# Altium project GateDriver_board.PrjPCB
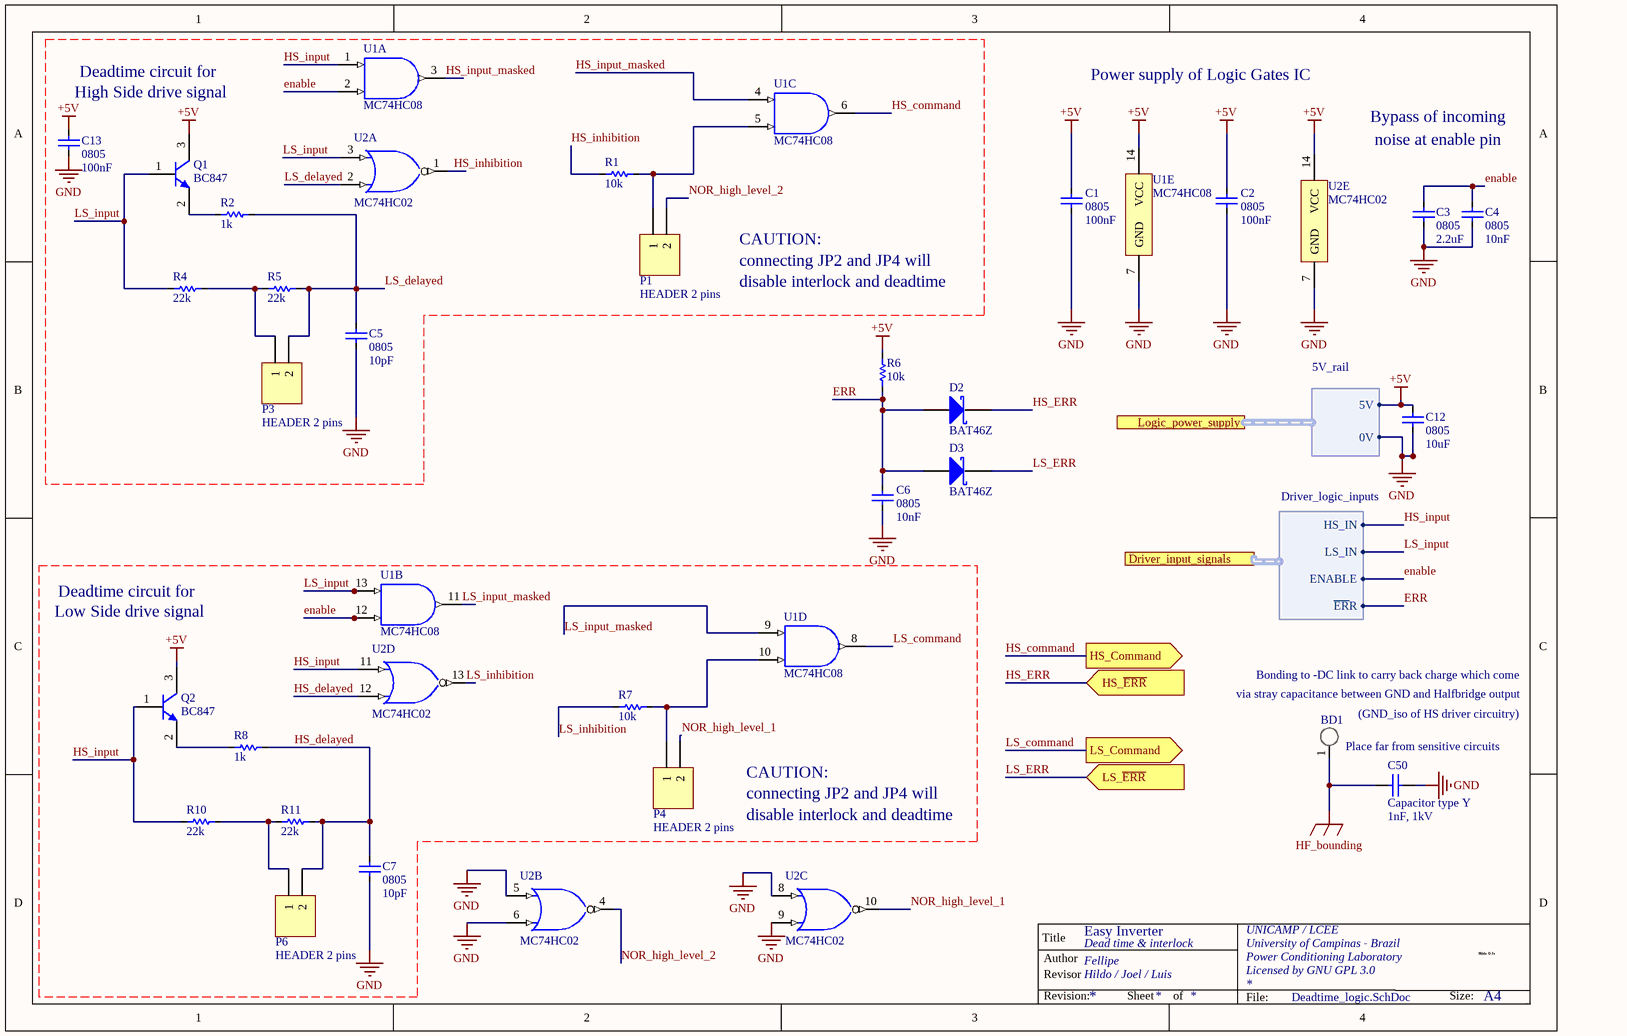
[diagram p0: Deadtime_logic.SchDoc]
2 sheets, 88 parts. Net scope: strictly hierarchical (ports join the sheet entries above them; power ports are local).
Board file: GateDriver_board_pcb.PcbDoc
Sheets:
  Deadtime_logic.SchDoc
  LowSide_Analog_protections.SchDoc

## Sheet Deadtime_logic.SchDoc: Dead time & interlock
size A4; CheckedBy: Hildo / Joel / Luis; Author: Fellipe; Organization: UNICAMP / LCEE; Address1: University of Campinas - Brazil; Address2: Power Conditioning Laboratory; Address3: Licensed by GNU GPL 3.0; ProjectName: Easy Inverter

### Parts
BD1  Place far from sensitive circuits  [Bonding_pad]
C1  0805  value 100nF  [Capacitor 0805]
C2  0805  value 100nF  [Capacitor 0805]
C3  0805  value 2.2uF  [Capacitor 0805]
C4  0805  value 10nF  [Capacitor 0805]
C5  0805  value 10pF  [Capacitor 0805]
C6  0805  value 10nF  [Capacitor 0805]
C7  0805  value 10pF  [Capacitor 0805]
C12  0805  value 10uF  [Capacitor 0805]
C13  0805  value 100nF  [Capacitor 0805]
C50  Capacitor type Y  value 1nF, 1kV  [CAPACITOR 1812]
D2  BAT46Z  [SOD 123]
D3  BAT46Z  [SOD 123]
P1  HEADER 2 pins  [HDR1X2 - Jumper]
P3  HEADER 2 pins  [HDR1X2 - Jumper]
P4  HEADER 2 pins  [HDR1X2 - Jumper]
P6  HEADER 2 pins  [HDR1X2 - Jumper]
Q1  BC847  [SOT 23]
Q2  BC847  [SOT 23]
R1  value 10k  [Resistor 0805]  (hidden comment: Resistor 0805)
R2  value 1k  [Resistor 0805]  (hidden comment: Resistor 0805)
R4  value 22k  [Resistor 0805]  (hidden comment: Resistor 0805)
R5  value 22k  [Resistor 0805]  (hidden comment: Resistor 0805)
R6  value 10k  [Resistor 0805]  (hidden comment: Resistor 0805)
R7  value 10k  [Resistor 0805]  (hidden comment: Resistor 0805)
R8  value 1k  [Resistor 0805]  (hidden comment: Resistor 0805)
R10  value 22k  [Resistor 0805]  (hidden comment: Resistor 0805)
R11  value 22k  [Resistor 0805]  (hidden comment: Resistor 0805)
U1  value MC74HC08  [SOIC 14]  (hidden comment: MC74HC08ADG)  (parts A,B,C,D,E of 5)
U2  value MC74HC02  [SOIC 14]  (hidden comment: MC74HC02ADG)  (parts A,B,C,D,E of 5)

### Ports
Driver_input_signals (harness Driver_logic_inputs), HS_Command (out), HS_~{ERR} (in), Logic_power_supply (harness 5V_rail), LS_Command (out), LS_~{ERR} (in)

### Harnesses
Driver_logic_inputs: HS_IN, LS_IN, ENABLE, ~{ER}R
5V_rail: 0V, 5V

### Nets
+5V: C1.1 C2.1 C12.1 C13.1 Q1.3(C) Q2.3(C) R6.2 U1.14(VCC) U2.14(VCC) ; port Logic_power_supply.5V
GND: C1.2 C2.2 C3.2 C4.2 C5.2 C6.2 C7.2 C12.2 C13.2 C50.2 U1.7(GND) U2.5(2A) U2.6(2B) U2.7(GND) U2.8(3A) U2.9(3B) ; port Logic_power_supply.0V
HF_bounding: BD1.1 C50.1
enable: C3.1 C4.1 U1.2(1B) U1.12(4A) ; port Driver_input_signals.ENABLE
ERR: C6.1 D2.1(A) D3.1(A) R6.1 ; port Driver_input_signals.~{ER}R
HS_command: U1.6(2Y) ; port HS_Command
HS_delayed: C7.1 P6.2 R8.2 R11.2 U2.12(4B)
HS_ERR: D2.2(K) ; port HS_~{ERR}
HS_inhibition: R1.1 U2.1(1Y)
HS_input: Q2.1(B) R10.1 U1.1(1A) U2.11(4A) ; port Driver_input_signals.HS_IN
HS_input_masked: U1.3(1Y) U1.4(2A)
LS_command: U1.8(3Y) ; port LS_Command
LS_delayed: C5.1 P3.2 R2.2 R5.2 U2.2(1A)
LS_ERR: D3.2(K) ; port LS_~{ERR}
LS_inhibition: R7.1 U2.13(4Y)
LS_input: Q1.1(B) R4.1 U1.13(4B) U2.3(1B) ; port Driver_input_signals.LS_IN
LS_input_masked: U1.9(3A) U1.11(4Y)
NOR_high_level_1: P4.2 U2.10(3Y)
NOR_high_level_2: P1.2 U2.4(2Y)
NetP1_1: P1.1 R1.2 U1.5(2B)
NetP3_1: P3.1 R4.2 R5.1
NetP4_1: P4.1 R7.2 U1.10(3B)
NetP6_1: P6.1 R10.2 R11.1
NetQ1_2: Q1.2(E) R2.1
NetQ2_2: Q2.2(E) R8.1

### Notes on the sheet
- (near C13) High Side drive signal
- Deadtime circuit for
- Power supply of Logic Gates IC
- Bypass of incoming
- noise at enable pin
- CAUTION:
- connecting JP2 and JP4 will
- disable interlock and deadtime
- Low Side drive signal
- (near BD1) via stray capacitance between GND and Halfbridge output
- Bonding to -DC link to carry back charge which come
- (near BD1) (GND_iso of HS driver circuitry)
- Title
- Author
- Revisor
- Hildo G Jr
- Revision:
- Sheet
- of
- File:
- Size:
- A4
- HGJr

### Library data of the parts
BD1 = Bonding_pad: Used to connect carry the currents  from the GND logic plane back to the -DC_link plane, which is originated by parasitic capacitive coupling between Halfbridge output and GND plane; value: none; pn: none
C1-C7 C12 C13 = Capacitor 0805: SMD ceramic capacitor 0805; pn: undefined
C50 = Y Capacitor: High Voltage Capacitor to filter EMC from heatsink; pn: C1210C104KBRAC7800, C1812C104KDRAC7800
D2 D3 = BAT46Z: DIODE SCHOTTKY 100V 150MA SOD123; pn: BAT46ZFILM; Value: BAT46Z
P1 = HEADER 2 pins: Header 2.54mm 2 pins; Jumper_text: Close to disable HS deadtime; PN: ?; Pin_1_signal: *; Pin_2_signal: *
P3 P6 = HEADER 2 pins: Header 2.54mm 2 pins; PN: ?; Pin_1_signal: *; Pin_2_signal: *
P4 = HEADER 2 pins: Header 2.54mm 2 pins; Jumper_text: Close to disable LS deadtime; PN: ?; Pin_1_signal: *; Pin_2_signal: *
Q1 Q2 = BC847BLT1G: General Purpose Transistor, NPN Silicon, 3-Pin SOT-23, Pb-Free, Tape and Reel; PN: BC847BLT1G; Value: BC847
R1 R2 R4-R8 R10 R11 = Resistor 0805: SMD resistor 0805; pn: undefined
U1 = MC74HC08ADG: Quadruple 2-Input Positive-AND Gates; ComponentLink2Description: Datasheet; ComponentLink2URL: http://www.ti.com/lit/ds/symlink/sn74hc08.pdf; PN: MC74HC08ADG
U2 = MC74HC02ADG: Logic Quad 2-Input NOR Gates; PN: MC74HC02ADG; ComponentLink2Description: Datasheet; ComponentLink2URL: http://www.ti.com/lit/ds/symlink/cd74hc02.pdf

## Sheet LowSide_Analog_protections.SchDoc: LowSide Analogic Protection
size A4; CheckedBy: Hildo / Joel / Luis; Author: Fellipe; Organization: UNICAMP / LCEE; Address1: University of Campinas - Brazil; Address2: Power Conditioning Laboratory; Address3: Licensed by GNU GPL 3.0; ProjectName: Easy Inverter
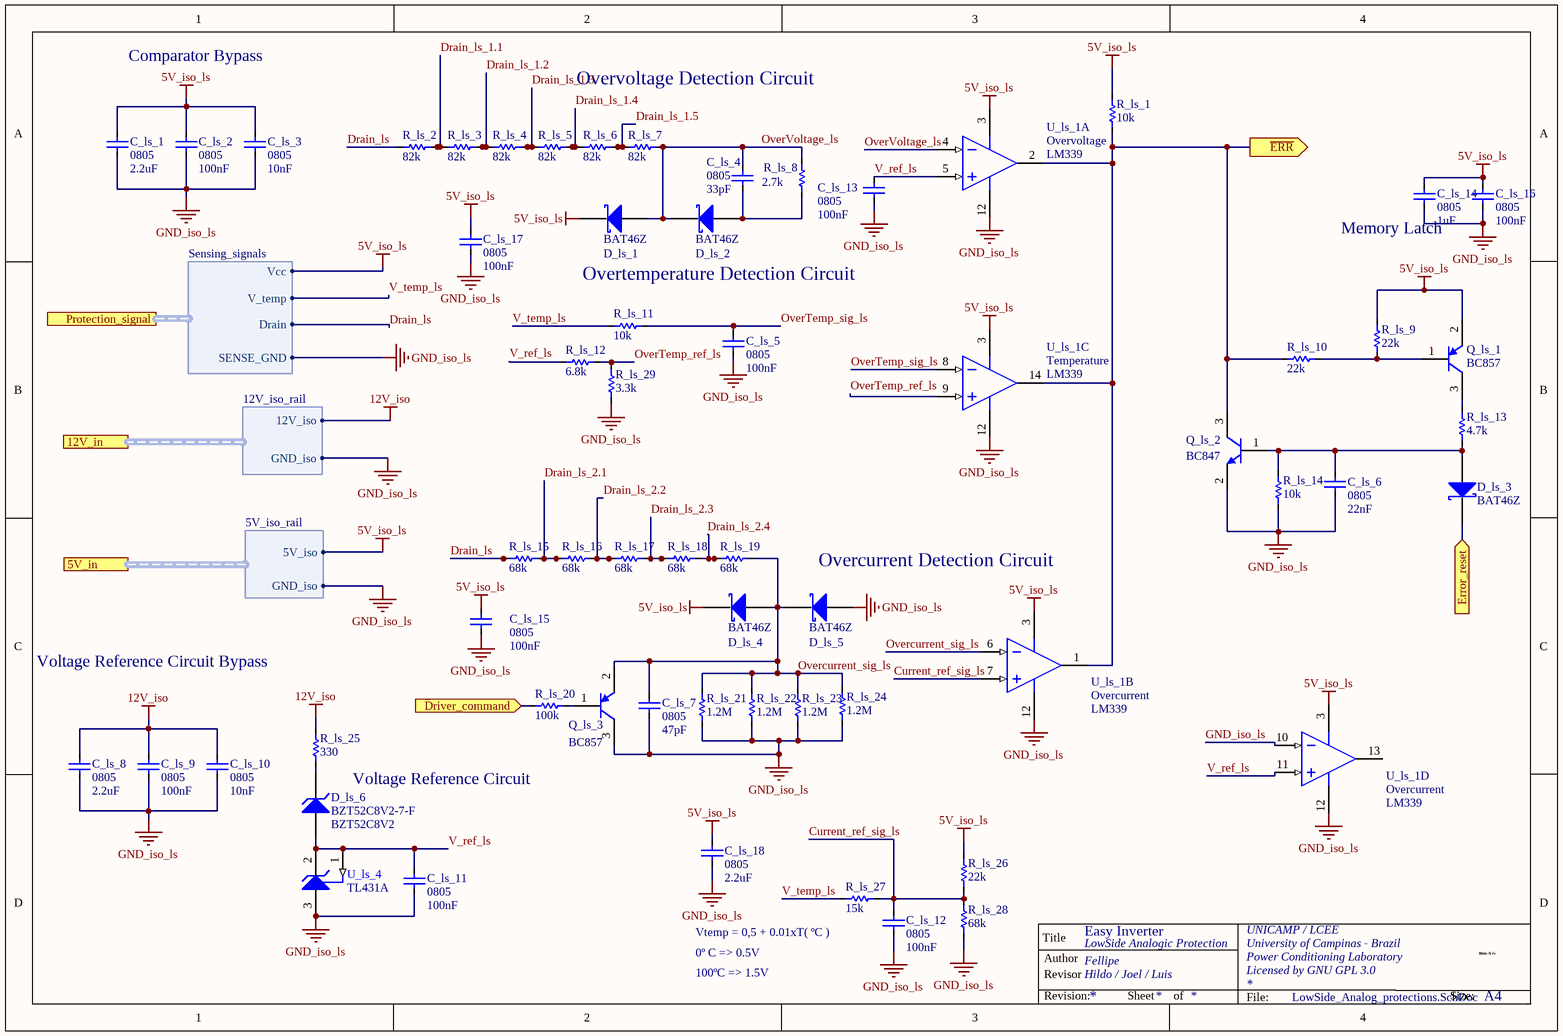
[diagram p1: LowSide_Analog_protections.SchDoc]

### Parts
C_ls_1  0805  value 2.2uF  [Capacitor 0805]
C_ls_2  0805  value 100nF  [Capacitor 0805]
C_ls_3  0805  value 10nF  [Capacitor 0805]
C_ls_4  0805  value 33pF  [Capacitor 0805]
C_ls_5  0805  value 100nF  [Capacitor 0805]
C_ls_6  0805  value 22nF  [Capacitor 0805]
C_ls_7  0805  value 47pF  [Capacitor 0805]
C_ls_8  0805  value 2.2uF  [Capacitor 0805]
C_ls_9  0805  value 100nF  [Capacitor 0805]
C_ls_10  0805  value 10nF  [Capacitor 0805]
C_ls_11  0805  value 100nF  [Capacitor 0805]
C_ls_12  0805  value 100nF  [Capacitor 0805]
C_ls_13  0805  value 100nF  [Capacitor 0805]
C_ls_14  0805  value 1uF  [Capacitor 0805]
C_ls_15  0805  value 100nF  [Capacitor 0805]
C_ls_16  0805  value 100nF  [Capacitor 0805]
C_ls_17  0805  value 100nF  [Capacitor 0805]
C_ls_18  0805  value 2.2uF  [Capacitor 0805]
D_ls_1  BAT46Z  [SOD 123]
D_ls_2  BAT46Z  [SOD 123]
D_ls_3  BAT46Z  [SOD 123]
D_ls_4  BAT46Z  [SOD 123]
D_ls_5  BAT46Z  [SOD 123]
D_ls_6  BZT52C8V2-7-F  value BZT52C8V2  [SOD 123]
Q_ls_1  BC857  [SOT 23]
Q_ls_2  BC847  [SOT 23]
Q_ls_3  BC857  [SOT 23]
R_ls_1  value 10k  [Resistor 0805]  (hidden comment: Resistor 0805)
R_ls_2  value 82k  [Resistor 0805]  (hidden comment: Resistor 0805)
R_ls_3  value 82k  [Resistor 0805]  (hidden comment: Resistor 0805)
R_ls_4  value 82k  [Resistor 0805]  (hidden comment: Resistor 0805)
R_ls_5  value 82k  [Resistor 0805]  (hidden comment: Resistor 0805)
R_ls_6  value 82k  [Resistor 0805]  (hidden comment: Resistor 0805)
R_ls_7  value 82k  [Resistor 0805]  (hidden comment: Resistor 0805)
R_ls_8  value 2.7k  [Resistor 0805]  (hidden comment: Resistor 0805)
R_ls_9  value 22k  [Resistor 0805]  (hidden comment: Resistor 0805)
R_ls_10  value 22k  [Resistor 0805]  (hidden comment: Resistor 0805)
R_ls_11  value 10k  [Resistor 0805]  (hidden comment: Resistor 0805)
R_ls_12  value 6.8k  [Resistor 0805]  (hidden comment: Resistor 0805)
R_ls_13  value 4.7k  [Resistor 0805]  (hidden comment: Resistor 0805)
R_ls_14  value 10k  [Resistor 0805]  (hidden comment: Resistor 0805)
R_ls_15  value 68k  [Resistor 0805]  (hidden comment: Resistor 0805)
R_ls_16  value 68k  [Resistor 0805]  (hidden comment: Resistor 0805)
R_ls_17  value 68k  [Resistor 0805]  (hidden comment: Resistor 0805)
R_ls_18  value 68k  [Resistor 0805]  (hidden comment: Resistor 0805)
R_ls_19  value 68k  [Resistor 0805]  (hidden comment: Resistor 0805)
R_ls_20  value 100k  [Resistor 0805]  (hidden comment: Resistor 0805)
R_ls_21  value 1.2M  [Resistor 0805]  (hidden comment: Resistor 0805)
R_ls_22  value 1.2M  [Resistor 0805]  (hidden comment: Resistor 0805)
R_ls_23  value 1.2M  [Resistor 0805]  (hidden comment: Resistor 0805)
R_ls_24  value 1.2M  [Resistor 0805]  (hidden comment: Resistor 0805)
R_ls_25  value 330  [Resistor 0805]  (hidden comment: Resistor 0805)
R_ls_26  value 22k  [Resistor 0805]  (hidden comment: Resistor 0805)
R_ls_27  value 15k  [Resistor 0805]  (hidden comment: Resistor 0805)
R_ls_28  value 68k  [Resistor 0805]  (hidden comment: Resistor 0805)
R_ls_29  value 3.3k  [Resistor 0805]  (hidden comment: Resistor 0805)
U_ls_1  Overvoltage  value LM339  [SOIC 14]  (parts A,B,C,D of 4)
U_ls_4  TL431A  [SOT 23]

### Ports
5V_in (harness 5V_iso_rail), 12V_in (harness 12V_iso_rail), Driver_command (in), Error_reset (in), Protection_signal (harness Sensing_signals), ~{ERR} (out)

### Harnesses
5V_iso_rail: GND_iso, 5V_iso
12V_iso_rail: GND_iso, 12V_iso
Sensing_signals: V_temp, Vcc, Drain, SENSE_GND

### Nets
5V_iso_ls: C_ls_1.1 C_ls_2.1 C_ls_3.1 C_ls_14.1 C_ls_15.1 C_ls_16.1 C_ls_17.1 C_ls_18.1 D_ls_1.2(K) D_ls_4.2(K) Q_ls_1.2(E) R_ls_1.2 R_ls_9.2 R_ls_26.2 U_ls_1.3(V+) ; port 5V_in.5V_iso, port Protection_signal.Vcc
12V_iso: C_ls_8.1 C_ls_9.1 C_ls_10.1 R_ls_25.2 ; port 12V_in.12V_iso
GND_iso_ls: C_ls_1.2 C_ls_2.2 C_ls_3.2 C_ls_5.2 C_ls_6.2 C_ls_7.2 C_ls_8.2 C_ls_9.2 C_ls_10.2 C_ls_11.2 C_ls_12.2 C_ls_13.2 C_ls_14.2 C_ls_15.2 C_ls_16.2 C_ls_17.2 C_ls_18.2 D_ls_5.1(A) Q_ls_2.2(E) Q_ls_3.3(C) R_ls_14.1 R_ls_21.1 R_ls_22.1 R_ls_23.1 R_ls_24.1 R_ls_28.1 R_ls_29.1 U_ls_1.10(IN4-) U_ls_1.12(GND) U_ls_4.3(ANODE) ; port 5V_in.GND_iso, port 12V_in.GND_iso, port Protection_signal.SENSE_GND
Current_ref_sig_ls: C_ls_12.1 R_ls_26.1 R_ls_27.2 R_ls_28.2 U_ls_1.7(IN2+)
Drain_ls: R_ls_2.1 R_ls_15.1 ; port Protection_signal.Drain
Drain_ls_1.1: R_ls_2.2 R_ls_3.1
Drain_ls_1.2: R_ls_3.2 R_ls_4.1
Drain_ls_1.3: R_ls_4.2 R_ls_5.1
Drain_ls_1.4: R_ls_5.2 R_ls_6.1
Drain_ls_1.5: R_ls_6.2 R_ls_7.1
Drain_ls_2.1: R_ls_15.2 R_ls_16.1
Drain_ls_2.2: R_ls_16.2 R_ls_17.1
Drain_ls_2.3: R_ls_17.2 R_ls_18.1
Drain_ls_2.4: R_ls_18.2 R_ls_19.1
Overcurrent_sig_ls: C_ls_7.1 D_ls_4.1(A) D_ls_5.2(K) Q_ls_3.2(E) R_ls_19.2 R_ls_21.2 R_ls_22.2 R_ls_23.2 R_ls_24.2 U_ls_1.6(IN2-)
OverTemp_ref_ls: R_ls_12.2 R_ls_29.2 U_ls_1.9(IN3+)
OverTemp_sig_ls: C_ls_5.1 R_ls_11.2 U_ls_1.8(IN3-)
OverVoltage_ls: C_ls_4.1 D_ls_1.1(A) D_ls_2.2(K) R_ls_7.2 R_ls_8.2 U_ls_1.4(IN1-)
V_ref_ls: C_ls_11.1 C_ls_13.1 D_ls_6.1(A) R_ls_12.1 U_ls_1.5(IN1+) U_ls_1.11(IN4+) U_ls_4.1(REF) U_ls_4.2(CATHODE)
V_temp_ls: R_ls_11.1 R_ls_27.1 ; port Protection_signal.V_temp
NetC_ls_4_2: C_ls_4.2 D_ls_2.1(A) R_ls_8.1
NetC_ls_6_1: C_ls_6.1 D_ls_3.1(A) Q_ls_2.1(B) R_ls_13.1 R_ls_14.2
NetD_ls_3_2: D_ls_3.2(K) ; port Error_reset
NetD_ls_6_2: D_ls_6.2(K) R_ls_25.1
NetQ_ls_1_1: Q_ls_1.1(B) R_ls_9.1 R_ls_10.2
NetQ_ls_1_3: Q_ls_1.3(C) R_ls_13.2
NetQ_ls_2_3: Q_ls_2.3(C) R_ls_1.1 R_ls_10.1 U_ls_1.1(OUT2) U_ls_1.2(OUT1) U_ls_1.14(OUT3) ; port ~{ERR}
NetQ_ls_3_1: Q_ls_3.1(B) R_ls_20.1
NetR_ls_20_2: R_ls_20.2 ; port Driver_command

Not connected (* = marked no-connect by the designer): U_ls_1 13(OUT4)

### Notes on the sheet
- Comparator Bypass
- Overvoltage Detection Circuit
- (near C_ls_14) Memory Latch
- Overtemperature Detection Circuit
- (near D_ls_5) Overcurrent Detection Circuit
- Voltage Reference Circuit Bypass
- Voltage Reference Circuit
- Vtemp = 0,5 + 0.01xT( ºC )
- 0º C => 0.5V
- 100ºC => 1.5V
- Title
- Author
- Revisor
- Hildo G Jr
- Revision:
- Sheet
- of
- File:
- Size:
- A4
- HGJr

### Library data of the parts
C_ls_1-C_ls_18 = Capacitor 0805: as C1 on sheet Deadtime_logic
  C_ls_1-C_ls_3 C_ls_13: ClassName: comparator_ls
  C_ls_4 C_ls_17: ClassName: overvoltage_circuitry_ls
  C_ls_5: ClassName: overtemperature_circuitry_ls
  C_ls_6 C_ls_14 C_ls_16: ClassName: memory_latch_ls
  C_ls_7 C_ls_12 C_ls_15: ClassName: overcurrent_circuitry_ls
  C_ls_8-C_ls_11: ClassName: voltage_ref_circuitry_ls, Direct_plane_connect
D_ls_1-D_ls_5 = BAT46Z: as D2 on sheet Deadtime_logic; Value: BAT46Z
  D_ls_1 D_ls_2: ClassName: overvoltage_circuitry_ls
  D_ls_3: ClassName: memory_latch_ls
  D_ls_4 D_ls_5: ClassName: overcurrent_circuitry_ls
D_ls_6 = BZT52C8V2-7-F: DIODE ZENER 8.2V 500MW SOD123; pn: BZT52C8V2-7-F; ClassName: voltage_ref_circuitry_ls
Q_ls_1 Q_ls_3 = BC857BLT1G: General Purpose Transistor, PNP Silicon, 3-Pin SOT-23, Pb-Free, Tape and Reel; PN: BC857BLT1G; Value: BC857
  Q_ls_1: ClassName: memory_latch_ls
  Q_ls_3: ClassName: overcurrent_circuitry_ls
Q_ls_2 = BC847BLT1G: as Q1 on sheet Deadtime_logic; PN: BC847BLT1G; Value: BC847; ClassName: memory_latch_ls
R_ls_1-R_ls_29 = Resistor 0805: SMD resistor 0805; pn: undefined
  R_ls_1: ClassName: memory_latch_ls; Parameter 1: *
  R_ls_2-R_ls_8: ClassName: overvoltage_circuitry_ls
  R_ls_9 R_ls_10 R_ls_13 R_ls_14: ClassName: memory_latch_ls
  R_ls_11: ClassName: overtemperature_circuitry_ls
  R_ls_15-R_ls_24 R_ls_26-R_ls_28: ClassName: overcurrent_circuitry_ls
  R_ls_25: ClassName: voltage_ref_circuitry_ls
U_ls_1 = LM339: Low Power Low Offset Voltage Quad Comparator, 14-pin Narrow SOIC; PN: LM339DT; ClassName: comparator_ls
U_ls_4 = TL431A: IC VREF SHUNT ADJ SOT23-3; pn: TL431AMFDT\,215; ComponentLink1Description: Manufacturer URL; ComponentLink1URL: http://www.ti.com/; ComponentLink2Description: Datasheet; ComponentLink2URL: http://www.ti.com/general/docs/lit/getliterature.tsp?genericPartNumber=TL431A&fileType=pdf; Parameter 2: TL431A; ClassName: voltage_ref_circuitry_ls